# EAGLE design juanK (EAGLE 8.2.2)
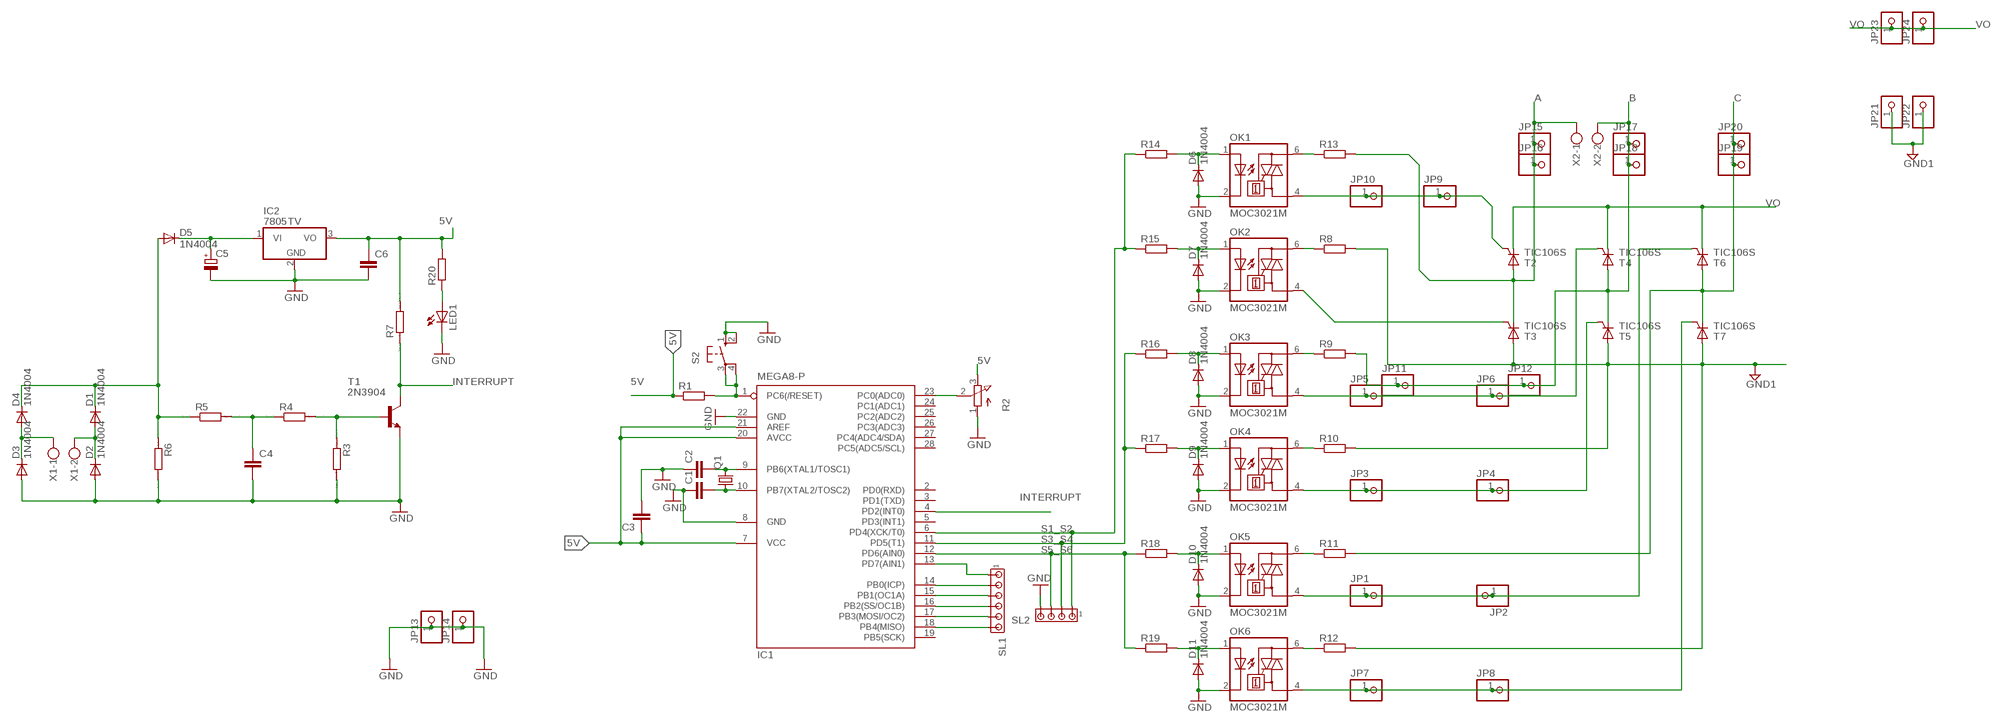
[diagram p0: schematic, sheet 1]

## Parts
C1  C2,5-3  [C2.5-3]
C2  C2,5-3  [C2.5-3]
C3  C2,5-3  [C2.5-3]
C4  C-EU025-025X050  [C025-025X050]
C5  CPOL-EUE5-10.5  [E5-10,5]
C6  C-EU025-025X050  [C025-025X050]
D1  1N4004  [DO41-10]
D2  1N4004  [DO41-10]
D3  1N4004  [DO41-10]
D4  1N4004  [DO41-10]
D5  1N4004  [DO41-10]
D6  1N4004  [DO41-10]
D7  1N4004  [DO41-10]
D8  1N4004  [DO41-10]
D9  1N4004  [DO41-10]
D10  1N4004  [DO41-10]
D11  1N4004  [DO41-10]
IC1  MEGA8-P  [DIL28-3]
IC2  7805TV  [TO220V]
JP1  PINHD-1X1  [1X01]
JP2  PINHD-1X1  [1X01]
JP3  PINHD-1X1  [1X01]
JP4  PINHD-1X1  [1X01]
JP5  PINHD-1X1  [1X01]
JP6  PINHD-1X1  [1X01]
JP7  PINHD-1X1  [1X01]
JP8  PINHD-1X1  [1X01]
JP9  PINHD-1X1  [1X01]
JP10  PINHD-1X1  [1X01]
JP11  PINHD-1X1  [1X01]
JP12  PINHD-1X1  [1X01]
JP13  PINHD-1X1  [1X01]
JP14  PINHD-1X1  [1X01]
JP15  PINHD-1X1  [1X01]
JP16  PINHD-1X1  [1X01]
JP17  PINHD-1X1  [1X01]
JP18  PINHD-1X1  [1X01]
JP19  PINHD-1X1  [1X01]
JP20  PINHD-1X1  [1X01]
JP21  PINHD-1X1  [1X01]
JP22  PINHD-1X1  [1X01]
JP23  PINHD-1X1  [1X01]
JP24  PINHD-1X1  [1X01]
LED1  LED3MM  [LED3MM]
OK1  MOC3021M  [DIL06]
OK2  MOC3021M  [DIL06]
OK3  MOC3021M  [DIL06]
OK4  MOC3021M  [DIL06]
OK5  MOC3021M  [DIL06]
OK6  MOC3021M  [DIL06]
Q1  CRYSTALHC49U70  [HC49U70]
R1  R-EU_0204/5  [0204/5]
R2  3RP/1610N  [3RP/1610N]
R3  R0204/7  [0204/7]
R4  R0204/7  [0204/7]
R5  R0204/7  [0204/7]
R6  R0204/7  [0204/7]
R7  R0204/7  [0204/7]
R8  R-EU_0817/22  [P0817/22]
R9  R-EU_0817/22  [P0817/22]
R10  R-EU_0817/22  [P0817/22]
R11  R-EU_0817/22  [P0817/22]
R12  R-EU_0817/22  [P0817/22]
R13  R-EU_0817/22  [P0817/22]
R14  R-EU_0204/7  [0204/7]
R15  R-EU_0204/7  [0204/7]
R16  R-EU_0204/7  [0204/7]
R17  R-EU_0204/7  [0204/7]
R18  R-EU_0204/7  [0204/7]
R19  R-EU_0204/7  [0204/7]
R20  R-EU_0204/5  [0204/5]
S2  10-XX  [B3F-10XX]
SL1  MTA06-100  [10X06MTA]
SL2  MTA04-100  [10X04MTA]
T1  2N3904  [TO92]
T2  TIC106S  [TIC106S]
T3  TIC106S  [TIC106S]
T4  TIC106S  [TIC106S]
T5  TIC106S  [TIC106S]
T6  TIC106S  [TIC106S]
T7  TIC106S  [TIC106S]
X1  W237-102  [W237-102]
X2  W237-102  [W237-102]

## Nets
5V: C3.1 C6.1 IC1.7(VCC) IC1.20(AVCC) IC1.21(AREF) IC2.3(VO) R1.1 R2.3(E) R7.2 R20.2
A: JP15.1 JP16.1 R13.2 T2.A T3.C X2.1
B: JP11.1 JP12.1 JP17.1 JP18.1 R9.2 T4.A T5.C X2.2
C: JP19.1 JP20.1 R11.2 T6.A T7.C
GND: C1.1 C2.1 C3.2 C4.2 C5.- C6.2 D2.A D3.A D6.A D7.A D8.A D9.A D10.A D11.A IC1.8(GND) IC1.22(GND) IC2.2(GND) JP13.1 JP14.1 LED1.K(C) OK1.2(C) OK2.2(C) OK3.2(C) OK4.2(C) OK5.2(C) OK6.2(C) R2.1(A) R3.2 R6.2 S2.1(S) S2.2(S1) SL2.4 T1.3(E)
GND1: JP21.1 JP22.1 R8.2 R10.2 R12.2 T3.A T5.A T7.A
INTERRUPT: IC1.4(PD2(INT0)) R7.1 T1.1(C)
N$1: C4.1 R4.1 R5.2
N$2: R3.1 R4.2 T1.2(B)
N$3: C5.+ D5.C IC2.1(VI)
N$4: OK2.6(A2) R8.1
N$5: D1.C D4.C D5.A R5.1 R6.1
N$6: JP9.1 JP10.1 OK1.4(A1) T2.G
N$7: IC1.23(PC0(ADC0)) R2.2(S)
N$8: JP1.1 JP2.1 OK5.4(A1) T6.G
N$9: IC1.14(PB0(ICP)) SL1.2
N$10: D3.C D4.A X1.1
N$11: D1.A D2.C X1.2
N$12: IC1.15(PB1(OC1A)) SL1.3
N$13: LED1.A R20.1
N$14: C2.2 IC1.9(PB6(XTAL1/TOSC1)) Q1.2
N$15: C1.2 IC1.10(PB7(XTAL2/TOSC2)) Q1.1
N$16: IC1.1(PC6(/RESET)) R1.2 S2.3(P) S2.4(P1)
N$17: OK1.6(A2) R13.1
N$18: OK3.6(A2) R9.1
N$19: IC1.16(PB2(SS/OC1B)) SL1.4
N$20: OK2.4(A1) T3.G
N$21: IC1.17(PB3(MOSI/OC2)) SL1.5
N$22: JP5.1 JP6.1 OK3.4(A1) T4.G
N$23: OK4.6(A2) R10.1
N$24: JP7.1 JP8.1 OK6.4(A1) T7.G
N$25: JP3.1 JP4.1 OK4.4(A1) T5.G
N$26: OK5.6(A2) R11.1
N$27: OK6.6(A2) R12.1
N$28: D6.C OK1.1(A) R14.2
N$30: D7.C OK2.1(A) R15.2
N$32: D8.C OK3.1(A) R16.2
N$35: D9.C OK4.1(A) R17.2
N$36: D10.C OK5.1(A) R18.2
N$37: D11.C OK6.1(A) R19.2
N$40: IC1.18(PB4(MISO)) SL1.6
N$41: IC1.13(PD7(AIN1)) SL1.1
S1_S2: IC1.6(PD4(XCK/T0)) R14.1 R15.1 SL2.1
S3_S4: IC1.11(PD5(T1)) R16.1 R17.1 SL2.2
S5_S6: IC1.12(PD6(AIN0)) R18.1 R19.1 SL2.3
VO: JP23.1 JP24.1 T2.C T4.C T6.C
Unconnected: IC1.2(PD0(RXD)) IC1.3(PD1(TXD)) IC1.5(PD3(INT1)) IC1.19(PB5(SCK)) IC1.24(PC1(ADC1)) IC1.25(PC2(ADC2)) IC1.26(PC3(ADC3)) IC1.27(PC4(ADC4/SDA)) IC1.28(PC5(ADC5/SCL))

## Library data of the parts
C1-C3 = capacitor-wima:C: CAPACITOR naming: grid - package width
C4 C6 = rcl:C-EU: CAPACITOR, European symbol
C5 = rcl:CPOL-EU: POLARIZED CAPACITOR, European symbol
D1-D11 = diode:1N4004: DIODE general purpose rectifier, 1 A
IC1 = atmel:MEGA8-P: MICROCONTROLLER 8 Kbytes FLASH, 1 kbytes SRAM, 512 bytes EEPROM, USART, 4-channel 10 bit ADC, 2-channel 8 bit ADC Pin compatible with Atmega48, ATMega88, ATMega168 Source: avr.lbr; OC_FARNELL: unknown; OC_NEWARK: unknown
IC2 = linear:78*: Positive VOLTAGE REGULATOR Source: http://cache.national.com/ds/LM/LM78L05.pdf http://www.fairchildsemi.com/ds/LM/LM7805.pdf
JP1-JP24 = pinhead:PINHD-1X1: PIN HEADER
LED1 = led:LED: LED OSRAM: - CHIPLED LG R971, LG N971, LY N971, LG Q971, LY Q971, LO R971, LY R971 LH N974, LH R974 LS Q976, LO Q976, LY Q976 LO Q996 - Hyper CHIPLED LW Q18S LB Q993, LB Q99A, LB R99A - SideLED LS A670, LO A670, LY A670, LG A670, LP A670 LB A673, LV A673, LT A673, LW A673 LH A674 LY A675 LS A676, LA A676, LO A676, LY A676, LW A676 LS A679, LY A679, LG A679 - Hyper Micro SIDELED® LS Y876, LA Y876, LO Y876, LY Y876 LT Y87S - SmartLED LW L88C, LW L88S LB L89C, LB L89S, LG L890 LS L89K, LO L89K, LY L89K LS L896, LA L896, LO L896, LY L896 - TOPLED LS T670, LO T670, LY T670, LG T670, LP T670 LSG T670, LSP T670, LSY T670, LOP T670, LYG T670 LG T671, LOG T671, LSG T671 LB T673, LV T673, LT T673, LW T673 LH T674 LS T676, LA T676, LO T676, LY T676, LB T676, LH T676, LSB T676, LW T676 LB T67C, LV T67C, LT T67C, LS T67K, LO T67K, LY T67K, LW E67C LS E67B, LA E67B, LO E67B, LY E67B, LB E67C, LV E67C, LT E67C LW T67C LS T679, LY T679, LG T679 LS T770, LO T770, LY T770, LG T770, LP T770 LB T773, LV T773, LT T773, LW T773 LH T774 LS E675, LA E675, LY E675, LS T675 LS T776, LA T776, LO T776, LY T776, LB T776 LHGB T686 LT T68C, LB T68C - Hyper Mini TOPLED® LB M676 - Mini TOPLED Santana® LG M470 LS M47K, LO M47K, LY M47K Source: http://www.osram.convergy.de LUXEON: - LUMILED® LXK2-PW12-R00, LXK2-PW12-S00, LXK2-PW14-U00, LXK2-PW14-V00 LXK2-PM12-R00, LXK2-PM12-S00, LXK2-PM14-U00 LXK2-PE12-Q00, LXK2-PE12-R00, LXK2-PE12-S00, LXK2-PE14-T00, LXK2-PE14-U00 LXK2-PB12-K00, LXK2-PB12-L00, LXK2-PB12-M00, LXK2-PB14-N00, LXK2-PB14-P00, LXK2-PB14-Q00 LXK2-PR12-L00, LXK2-PR12-M00, LXK2-PR14-Q00, LXK2-PR14-R00 LXK2-PD12-Q00, LXK2-PD12-R00, LXK2-PD12-S00 LXK2-PH12-R00, LXK2-PH12-S00 LXK2-PL12-P00, LXK2-PL12-Q00, LXK2-PL12-R00 Source: www.luxeon.com KINGBRIGHT: KA-3528ASYC Source: www.kingbright.com
OK1-OK6 = optocoupler:MOC30*M: RANDOM-PHASE OPTOISOLATORS TRIAC DRIVER OUTPUT Source: http://www.fairchildsemi.com MOC3020-M.pdf; MF: FAIRCHILD SEMICONDUCTOR; MPN: MOC3021-M; OC_FARNELL: 1021365; OC_NEWARK: 95B7895
Q1 = crystal:CRYSTAL: CRYSTAL; OC_FARNELL: unknown; OC_NEWARK: unknown
R1 R20 = rcl:R-EU_: RESISTOR, European symbol
R2 = pot:3RP/1610N: 16mm Potentiometer one level Source: http://www.alphapotentiometers.net/html/16mm_pot_2.html
R3-R7 = eagle-ltspice:R: RESISTOR, European symbol; SPICEMODEL: NONE; SPICEPREFIX: R
R8-R19 = resistor:R-EU_: RESISTOR, European symbol
S2 = switch-omron:10-XX: OMRON SWITCH; MPN: B3F-1000; OC_FARNELL: 176432; OC_NEWARK: 36M3542
SL1 = con-amp:MTA06-100: AMP connector Connection corrected 2014-09-19
SL2 = con-amp:MTA04-100: AMP connector
T1 = transistor:2N3904: NPN TRANSISTOR
T2-T7 = triac:TIC106S: THYRISTOR
X1 X2 = con-wago-500:W237-102: WAGO SCREW CLAMP; MPN: 237-102; OC_FARNELL: unknown; OC_NEWARK: 70K9898

## Net classes
0 default: width 0.508 mm, drill 0.508 mm, clearance 0.889 mm
1 power: width 0.762 mm, drill 0.762 mm, clearance 2.54 mm

## Board
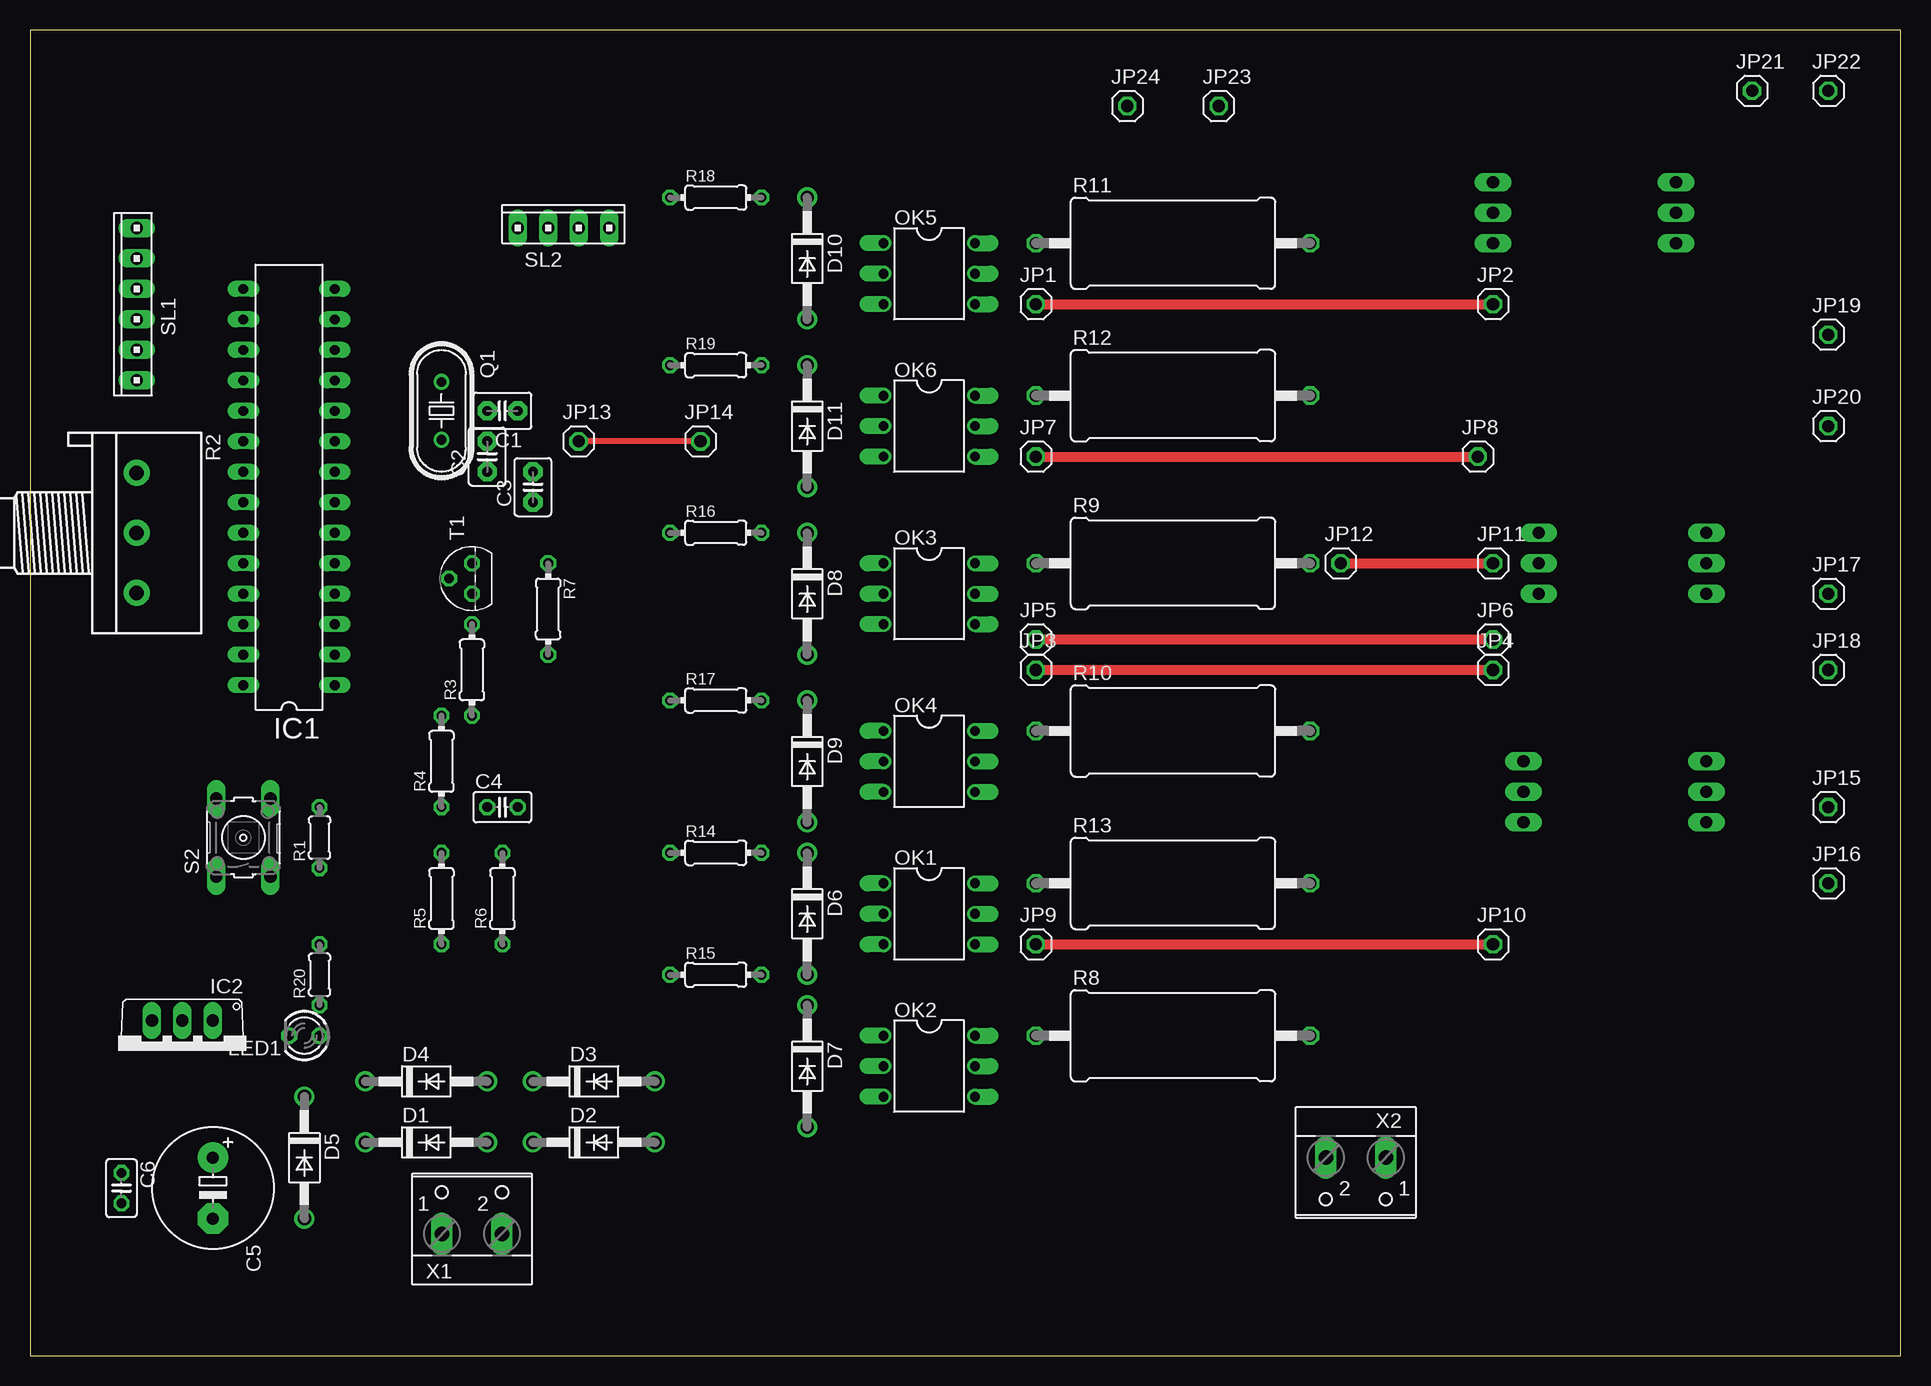
[diagram p1: board, top side]
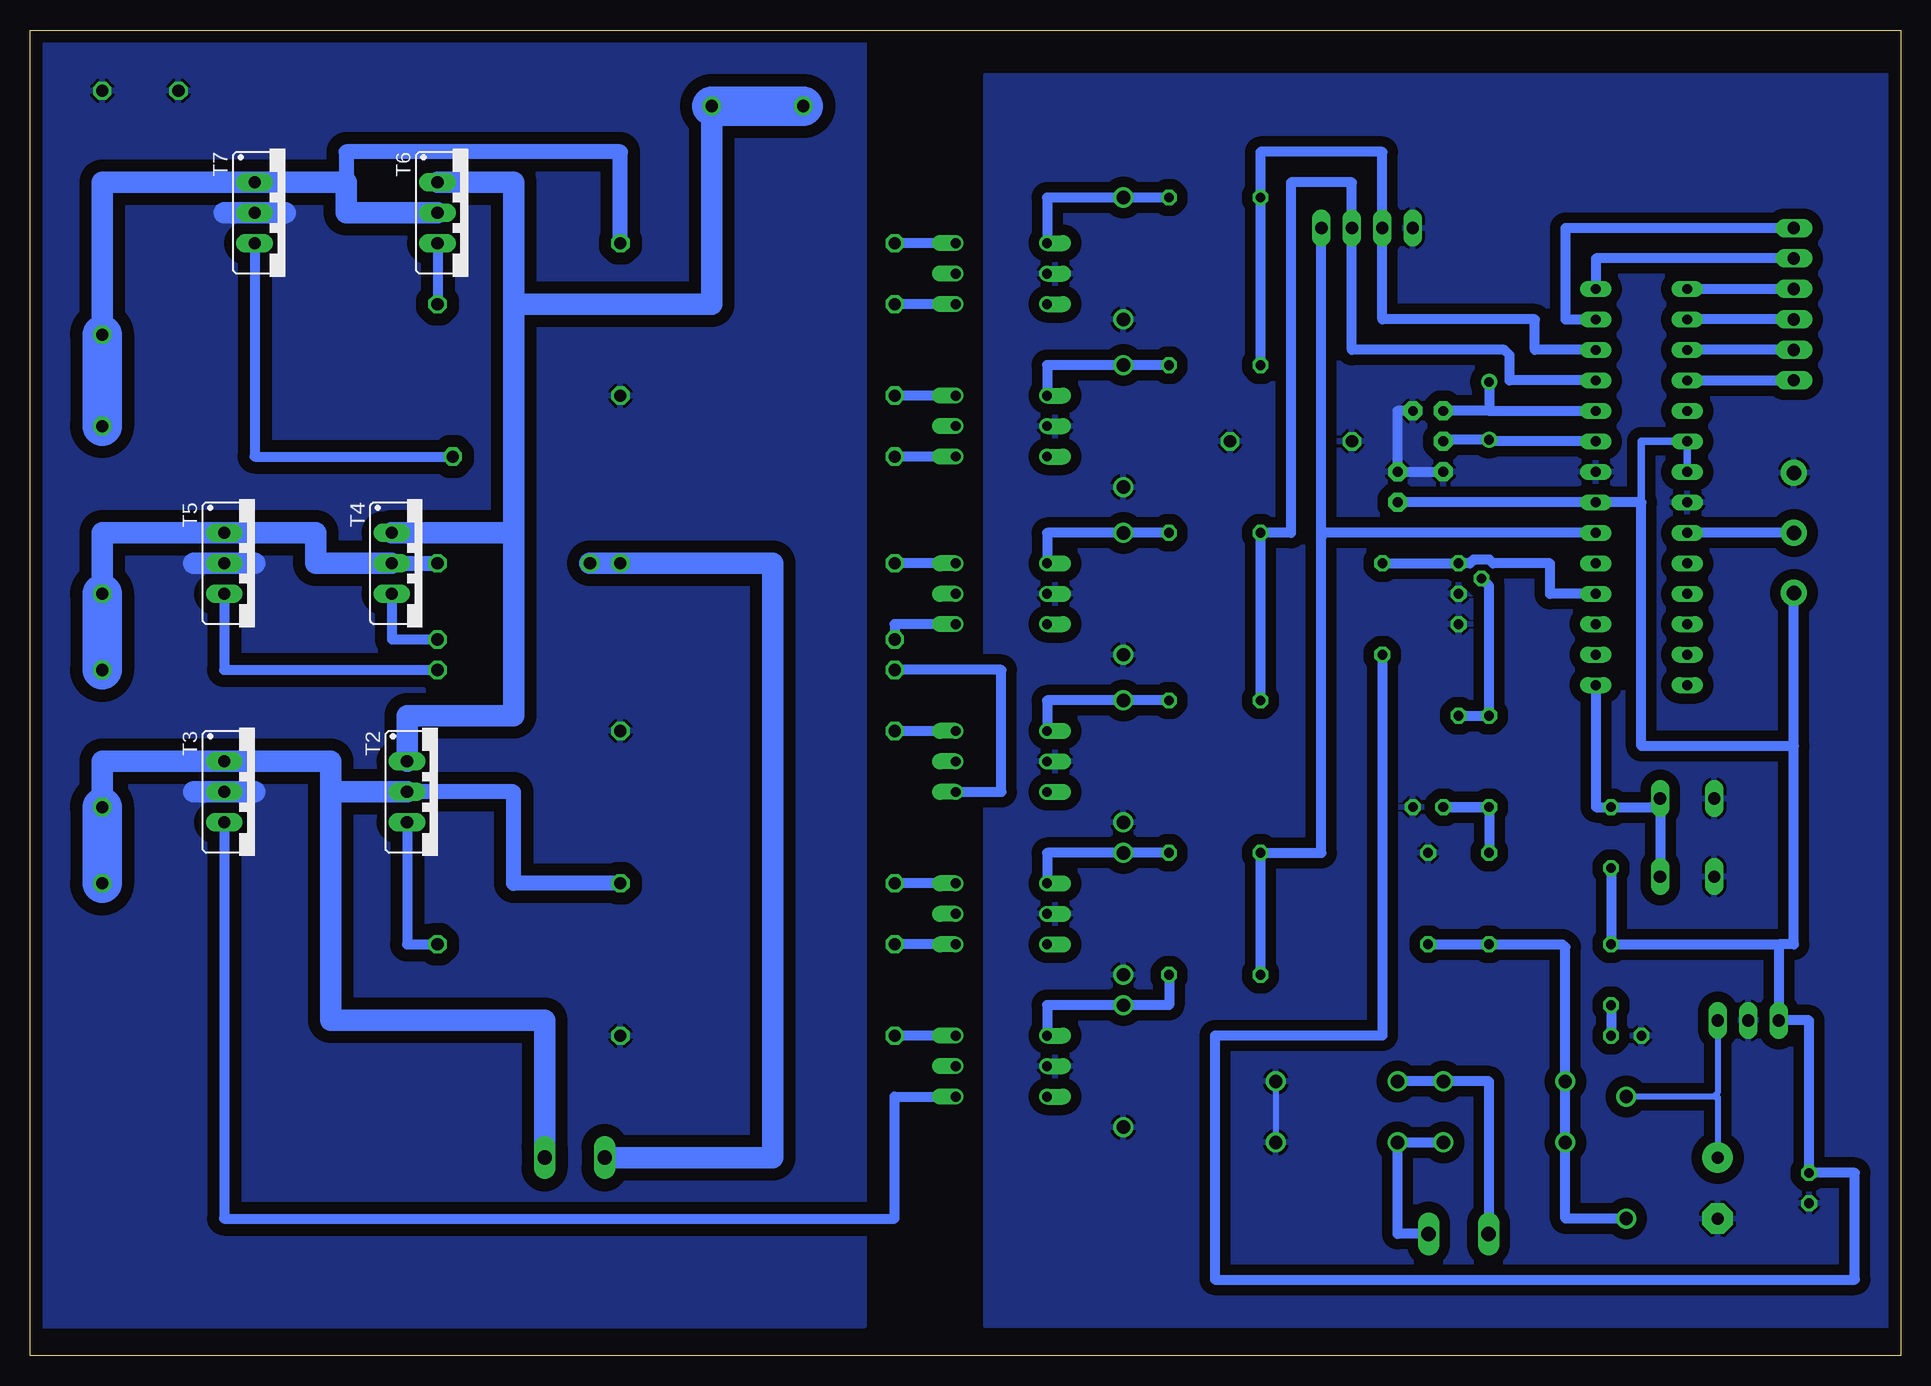
[diagram p2: board, bottom side, seen from below]

Size 155.88 x 110.48 mm. Coordinates in mm from the lower left corner, seen from the top.
Outline: 0,0 155.88,0 155.88,110.48 0,110.48 0,0
Copper layers (1*16): Top 0.035mm / dielectric 1.5mm / Bottom 0.035mm
Design rules "default": minimum track width 10mil, minimum drill 24mil, track to track 8mil, track to pad 8mil, pad to pad 8mil, via to via 8mil, smd to smd 8mil, copper to edge 40mil, drill to drill 8mil, minimum pad ring 10mil, minimum via ring 8mil, stop-mask expansion 4mil, vias tented up to drill 0mil, thermal gap 10mil

### Footprints (pad centres in the part's own frame; a part is rotated, then mirrored left to right if it is on the bottom)
C2.5-3 = drill 0.813 pad 1.6 octagon: 1 -1.27,0; 2 1.27,0
C025-025X050 = drill 0.813 octagon: 1 -1.27,0; 2 1.27,0
E5-10,5 = drill 1.016 pad 2.54: + -2.54,0 | drill 1.016 pad 2.54 octagon: - 2.54,0
DO41-10 = drill 1.118: A 5.08,0; C -5.08,0
DIL28-3 = drill 0.813 long: 1 -16.51,-3.81; 2 -13.97,-3.81; 3 -11.43,-3.81; 4 -8.89,-3.81; 5 -6.35,-3.81; 6 -3.81,-3.81; 7 -1.27,-3.81; 8 1.27,-3.81; 9 3.81,-3.81; 10 6.35,-3.81; 11 8.89,-3.81; 12 11.43,-3.81; 13 13.97,-3.81; 14 16.51,-3.81; 15 16.51,3.81; 16 13.97,3.81; 17 11.43,3.81; 18 8.89,3.81; 19 6.35,3.81; 20 3.81,3.81; 21 1.27,3.81; 22 -1.27,3.81; 23 -3.81,3.81; 24 -6.35,3.81; 25 -8.89,3.81; 26 -11.43,3.81; 27 -13.97,3.81; 28 -16.51,3.81
TO220V = drill 1.016 long: 1 -2.54,-2.54; 2 0,-2.54; 3 2.54,-2.54
1X01 = drill 1.016 octagon: 1 0,0
LED3MM = drill 0.813 octagon: A -1.27,0; K 1.27,0
DIL06 = drill 0.813 offset: 1 -2.54,-3.81; 2 0,-3.81; 3 2.54,-3.81; 4 2.54,3.81; 5 0,3.81; 6 -2.54,3.81
HC49U70 = drill 0.813: 1 -2.413,0; 2 2.413,0
0204/5 = drill 0.813 octagon: 1 -2.54,0; 2 2.54,0
3RP/1610N = drill 1.2 pad 2.184: 1 -5,0; 2 0,0; 3 5,0
0204/7 = drill 0.813 octagon: 1 -3.81,0; 2 3.81,0
P0817/22 = drill 1.016 octagon: 1 -11.43,0; 2 11.43,0
B3F-10XX = drill 1.016 long: 1 -3.251,2.261; 2 3.251,2.261; 3 -3.251,-2.261; 4 3.251,-2.261
10X06MTA = drill 1.016 long: 1 6.35,0; 2 3.81,0; 3 1.27,0; 4 -1.27,0; 5 -3.81,0; 6 -6.35,0
10X04MTA = drill 1.016 long: 1 3.81,0; 2 1.27,0; 3 -1.27,0; 4 -3.81,0
TO92 = drill 0.813 octagon: 1 1.27,0; 2 0,1.905; 3 -1.27,0
TIC106S = drill 1.016 long: A 0,-2.54; C -2.54,-2.54; G 2.54,-2.54
W237-102 = drill 1.194 long: 1 -2.5,-1.27; 2 2.5,-1.27

### Placement (x,y rotation side)
C1  39.37,78.74 180 top
C2  38.1,74.93 90 top
C3  41.91,72.39 90 top
C4  39.37,45.72 0 top
C5  15.24,13.97 270 top
C6  7.62,13.97 270 top
D1  33.02,17.78 0 top
D2  46.99,17.78 0 top
D3  46.99,22.86 0 top
D4  33.02,22.86 0 top
D5  22.86,16.51 270 top
D6  64.77,36.83 270 top
D7  64.77,24.13 270 top
D8  64.77,63.5 270 top
D9  64.77,49.53 270 top
D10  64.77,91.44 270 top
D11  64.77,77.47 270 top
IC1  21.59,72.39 90 top
IC2  12.7,25.4 180 top
JP1  83.82,87.63 0 top
JP2  121.92,87.63 0 top
JP3  83.82,57.15 0 top
JP4  121.92,57.15 0 top
JP5  83.82,59.69 0 top
JP6  121.92,59.69 0 top
JP7  83.82,74.93 0 top
JP8  120.65,74.93 0 top
JP9  83.82,34.29 0 top
JP10  121.92,34.29 0 top
JP11  121.92,66.04 0 top
JP12  109.22,66.04 0 top
JP13  45.72,76.2 0 top
JP14  55.88,76.2 0 top
JP15  149.86,45.72 0 top
JP16  149.86,39.37 0 top
JP17  149.86,63.5 0 top
JP18  149.86,57.15 0 top
JP19  149.86,85.09 0 top
JP20  149.86,77.47 0 top
JP21  143.51,105.41 0 top
JP22  149.86,105.41 0 top
JP23  99.06,104.14 0 top
JP24  91.44,104.14 0 top
LED1  22.86,26.67 180 top
OK1  74.93,36.83 270 top
OK2  74.93,24.13 270 top
OK3  74.93,63.5 270 top
OK4  74.93,49.53 270 top
OK5  74.93,90.17 270 top
OK6  74.93,77.47 270 top
Q1  34.29,78.74 270 top
R1  24.13,43.18 90 top
R2  8.89,68.58 270 top
R3  36.83,57.15 90 top
R4  34.29,49.53 90 top
R5  34.29,38.1 90 top
R6  39.37,38.1 90 top
R7  43.18,62.23 270 top
R8  95.25,26.67 0 top
R9  95.25,66.04 0 top
R10  95.25,52.07 0 top
R11  95.25,92.71 0 top
R12  95.25,80.01 0 top
R13  95.25,39.37 0 top
R14  57.15,41.91 0 top
R15  57.15,31.75 0 top
R16  57.15,68.58 0 top
R17  57.15,54.61 0 top
R18  57.15,96.52 0 top
R19  57.15,82.55 0 top
R20  24.13,31.75 90 top
S2  17.78,43.18 90 top
SL1  8.89,87.63 90 top
SL2  44.45,93.98 0 top
T1  36.83,64.77 90 top
T2  121.92,46.99 270 bottom
T3  137.16,46.99 270 bottom
T4  123.19,66.04 270 bottom
T5  137.16,66.04 270 bottom
T6  119.38,95.25 270 bottom
T7  134.62,95.25 270 bottom
X1  36.83,11.43 0 top
X2  110.49,15.24 180 top

### Tracks (layer width: path | path; a pad name or v marks a point on that pad's centre or on a via)
5V
  Bottom 0.61: IC1.21 IC1.20 21.59,76.2 21.59,71.12
  Bottom 0.813: 10.16,34.29 IC2.3 7.62,27.94 C6.1 3.81,15.24 3.81,6.35 57.15,6.35 57.15,26.67 43.18,26.67 R7.2 | 10.16,34.29 R20.2 R1.1 | 8.89,50.8 8.89,34.29 10.16,34.29 | IC1.7 21.59,71.12 21.59,50.8 8.89,50.8 | IC1.7 25.64,71.12 | 17.7,73.58 IC1.21 | 8.89,50.8 R2.3 | IC1.7 C3.1
A
  Bottom 1.27: R13.2 115.57,39.37 115.57,46.99 T2.A
  Bottom 1.778: T2.A 130.81,46.99 | 130.81,46.99 130.81,49.53 T3.C 149.86,49.53 JP15.1 | 130.81,46.99 130.81,27.94 112.99,27.94 X2.1
  Bottom 3.302: JP15.1 JP16.1
B
  Top 0.813: JP12.1 JP11.1
  Bottom 1.27: T4.A JP11.1
  Bottom 1.778: T4.A 132.08,66.04 132.08,68.58 T5.C 149.86,68.58 JP17.1 | JP12.1 R9.2 93.98,66.04 93.98,16.51 X2.2
  Bottom 3.302: JP17.1 JP18.1
C
  Bottom 1.27: R11.2 106.68,100.33 129.54,100.33 129.54,97.79
  Bottom 1.778: T6.A 129.54,95.25 129.54,97.79 T7.C 149.86,97.79 JP19.1
  Bottom 3.302: JP19.1 JP20.1
GND
  Top 0.508: JP14.1 JP13.1
  Bottom 0.508: D3.A D2.A
  Bottom 0.813: C1.1 41.91,78.74 C3.2 C2.1
  pour Bottom (isolate 0.406): 0,2.54 76.2,2.54 76.2,106.68 0,106.68
GND1
  Bottom 1.778: 139.7,95.25 T7.A 134.62,95.25 | 142.24,66.04 T5.A 137.16,66.04 | 142.24,46.99 T3.A 137.16,46.99
  pour Bottom (isolate 1.016, rank 2): 86.36,110.49 156.21,110.49 156.21,2.54 86.36,2.54
INTERRUPT
  Bottom 0.813: IC1.4 29.21,63.5 arc90 29.21,63.5 29.21,66.04 33.97,66.04 34.27,66.34 35.58,66.34 35.88,66.04 T1.1 R7.1
N$1
  Bottom 0.813: 34.29,45.61 R4.1 | R4.1 C4.1 R4.1 | R4.1 R5.2
N$2
  Bottom 0.813: T1.2 34.29,64.14 R4.2 R3.1
N$3
  Bottom 0.508: 15.55,21.59 D5.C | 15.55,21.59 15.24,21.59 C5.+ | IC2.1 15.24,21.9 15.55,21.59
N$4
  Bottom 0.813: OK2.6 R8.1
N$5
  Bottom 0.508: 27.94,11.43 D1.C D4.C 27.94,34.05 27.94,34.29 R5.1 R6.1
  Bottom 0.813: R6.1 28.18,34.29 27.94,34.05 27.94,11.43 D5.A
N$6
  Top 0.813: JP9.1 JP10.1
  Bottom 0.813: OK1.4 JP9.1 | T2.G 124.46,34.29 JP10.1
N$7
  Bottom 0.813: R2.2 IC1.23
N$8
  Top 0.813: JP1.1 JP2.1
  Bottom 0.813: OK5.4 JP1.1 | T6.G JP2.1
N$9
  Bottom 0.813: SL1.2 25.4,91.44 IC1.14
N$10
  Bottom 0.813: X1.1 34.29,10.16 34.29,22.86 D4.A D3.C
N$11
  Bottom 0.813: X1.2 41.91,10.16 D2.C D1.A
N$12
  Bottom 0.813: IC1.15 SL1.3
N$13
  Bottom 0.813: R20.1 LED1.A
N$14
  Bottom 0.813: IC1.9 34.16,76.2 Q1.2 37.97,76.33 C2.2
N$15
  Bottom 0.813: 25.4,78.61 IC1.10 34.3,78.74 | 34.3,78.74 C1.2 | Q1.1 34.29,78.75 34.3,78.74
N$16
  Bottom 0.813: IC1.1 25.4,45.72 R1.2 20.75,45.72 arc-90 S2.4 S2.3
N$17
  Bottom 0.813: OK1.6 R13.1
N$18
  Bottom 0.813: OK3.6 R9.1
N$19
  Bottom 0.813: SL1.4 IC1.16
N$20
  Bottom 0.813: OK2.4 83.82,21.59 83.82,11.43 139.7,11.43 T3.G
N$21
  Bottom 0.813: SL1.5 IC1.17
N$22
  Top 0.813: JP5.1 JP6.1
  Bottom 0.813: OK3.4 83.82,60.96 JP5.1 | T4.G 125.73,59.69 JP6.1
N$23
  Bottom 0.813: R10.1 OK4.6
N$24
  Top 0.813: JP7.1 JP8.1
  Bottom 0.813: OK6.4 JP7.1 | T7.G 137.16,74.93 JP8.1
N$25
  Top 0.813: JP3.1 JP4.1
  Bottom 0.813: OK4.4 74.93,46.99 74.93,57.15 JP3.1 | JP4.1 139.7,57.15 T5.G
N$26
  Bottom 0.813: OK5.6 R11.1
N$27
  Bottom 0.813: OK6.6 R12.1
N$28
  Bottom 0.508: OK1.1 71.12,41.91 D6.C R14.2
  Bottom 0.813: R14.2 71.12,41.91 OK1.1
N$30
  Bottom 0.813: R15.2 60.96,29.21 D7.C 71.12,29.21 OK2.1
N$32
  Bottom 0.508: R16.2 D8.C 65.29,68.58 71.12,68.58 OK3.1
  Bottom 0.813: R16.2 65.29,68.58 | D8.C 71.12,68.58 OK3.1
N$35
  Bottom 0.813: R17.2 D9.C 71.12,54.61 OK4.1
N$36
  Bottom 0.813: R18.2 D10.C 71.12,96.52 OK5.1
N$37
  Bottom 0.813: R19.2 D11.C 71.12,82.55 OK6.1
N$40
  Bottom 0.813: IC1.18 SL1.6
N$41
  Bottom 0.813: SL1.1 27.94,93.98 27.94,86.36 IC1.13
S1_S2
  Bottom 0.508: IC1.6 48.26,68.58 48.26,68.2 48.26,41.91 R14.1
  Bottom 0.813: IC1.6 48.26,68.58 | 48.26,68.58 48.26,68.2 | 48.26,68.58 SL2.1 | 48.26,68.58 48.26,41.91 R14.1 R15.1
S3_S4
  Bottom 0.813: R17.1 R16.1 50.8,68.58 50.8,97.79 45.72,97.79 SL2.2 45.72,83.82 33.02,83.82 32.59,83.39 32.59,81.28 IC1.11
S5_S6
  Bottom 0.813: R19.1 R18.1 53.34,100.33 43.18,100.33 SL2.3 43.18,86.36 30.48,86.36 30.48,83.82 IC1.12
VO
  Bottom 1.778: T4.C 115.57,68.58 | 115.57,87.63 115.57,68.58 | 115.57,68.58 115.57,53.34 124.46,53.34 T2.C | 115.57,87.63 99.06,87.63 JP23.1 | T6.C 115.57,97.79 115.57,87.63
  Bottom 3.302: JP24.1 JP23.1